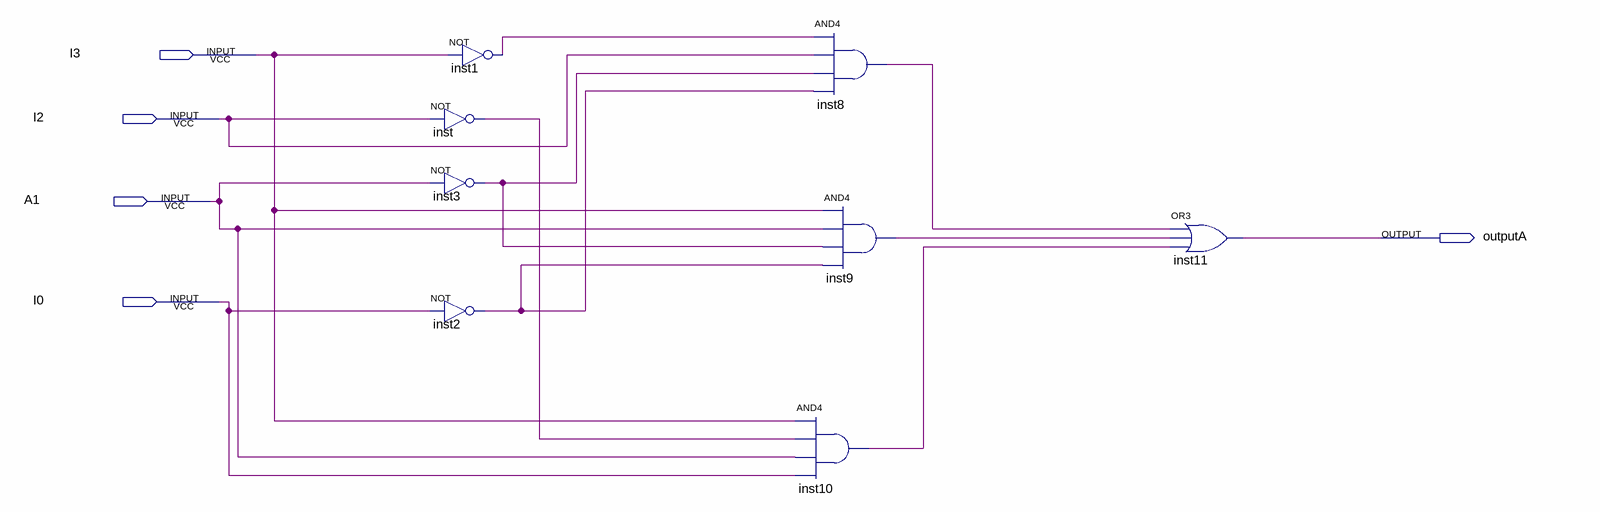
[diagram p0: schematic sheet]
// Quartus schematic outputA.bdf as structural Verilog: 8 symbols, 5 pins
module outputA (
  input  I3,
  input  I2,
  input  A1,
  input  I0,
  output outputA
);

  wire inst1_out, inst2_out, inst3_out, inst8_out, inst9_out, inst10_out, inst_out;

  not inst1 (inst1_out, I3);
  not inst (inst_out, I2);
  not inst3 (inst3_out, A1);
  not inst2 (inst2_out, I0);
  and inst8 (inst8_out, inst1_out, I2, inst3_out, inst2_out);
  and inst10 (inst10_out, I3, inst_out, A1, I0);
  and inst9 (inst9_out, I3, A1, inst3_out, inst2_out);
  or inst11 (outputA, inst8_out, inst9_out, inst10_out);
endmodule
